# Altium schematic sheet LoRa_module_Power.SchDoc
size A4
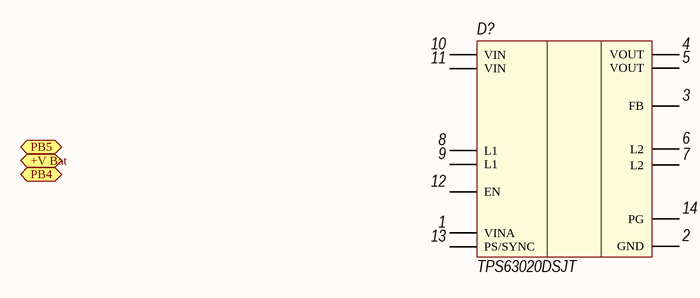
[diagram p0: LoRa_module_Power.SchDoc]

## Parts
D?  TPS63020DSJT

## Ports
+V Bat, PB4, PB5

## Nets

Not connected (* = marked no-connect by the designer): D? 1(VINA) 2(GND) 3(FB) 4(VOUT) 5(VOUT) 6(L2) 7(L2) 8(L1) 9(L1) 10(VIN) 11(VIN) 12(EN) 13(PS/SYNC) 14(PG)

## Library data of the parts
D? = TPS63020DSJT: DC-DC StepUp; Manufacture: Texas Instruments; Model: TPS63020DSJT; Case: VSON (14); Help URL: *